# Altium schematic sheet SiLPA_HE_LVDS_IFC.SchDoc: SiLPA HE
size 420 x 297 mm; EDA_Number: ARTIQ; Projet: ARTIQ/SINARA; Author: G.Kasprowicz; CompanyName: WUT ISE; DrawnBy: G.Kasprowicz; Organization: WUT ISE; Address1: PW ISE; Address2: Nowowiejska 15/19 00-665 Warsaw; Address3: gkasprow@gmail.com; DocumentNumber: 7; Revision: 2; SheetNumber: 7; SheetTotal: 7; ModifiedBy: -; CheckedDate: -; Title2: EEM connectors; DivGrp: WUT ISE; Designer: G.Kasprowicz; SPICEModelCache: <root> / <DocumentId>MJNKMGWL</DocumentId> / <CacheFrame Number="0"> / <Model Name="pk14" Kind="CKT"> / <Text>*.INC dhvqfn.s / .SUBCKT pk14 / +    1   2   3   4   5   6   7   8   9  10 / +   11  12  13  14 / +   15  16  17  18  19  20  21  22  23  24 / +   25  26  27  28 / * Pin Resistance / r1 1 1001 9.078E-02 / r2 2 1002 8.829E-02 / r3 3 1003 8.731E-02 / r4 4 1004 8.710E-02 / r5 5 1005 8.731E-02 / r6 6 1006 8.829E-02 / r7 7 1007 9.075E-02 / r8 8 1008 9.072E-02 / r9 9 1009 8.809E-02 / r10 10 1010 8.716E-02 / r11 11 1011 8.706E-02 / r12 12 1012 8.720E-02 / r13 13 1013 8.816E-02 / r14 14 1014 9.068E-02 / * Pin Inductance / l1 1001 15 2.981E-09 / l2 1002 16 2.447E-09 / l3 1003 17 2.304E-09 / l4 1004 18 2.291E-09 / l5 1005 19 2.307E-09 / l6 1006 20 2.449E-09 / l7 1007 21 2.971E-09 / l8 1008 22 2.972E-09 / l9 1009 23 2.425E-09 / l10 1010 24 2.286E-09 / l11 1011 25 2.280E-09 / l12 1012 26 2.286E-09 / l13 1013 27 2.425E-09 / l14 1014 28 2.975E-09 / .ENDS pk14</Text> / </Model> / </CacheFrame> / </root>; ModifiedDate: -; ProjectName: Sensor Box
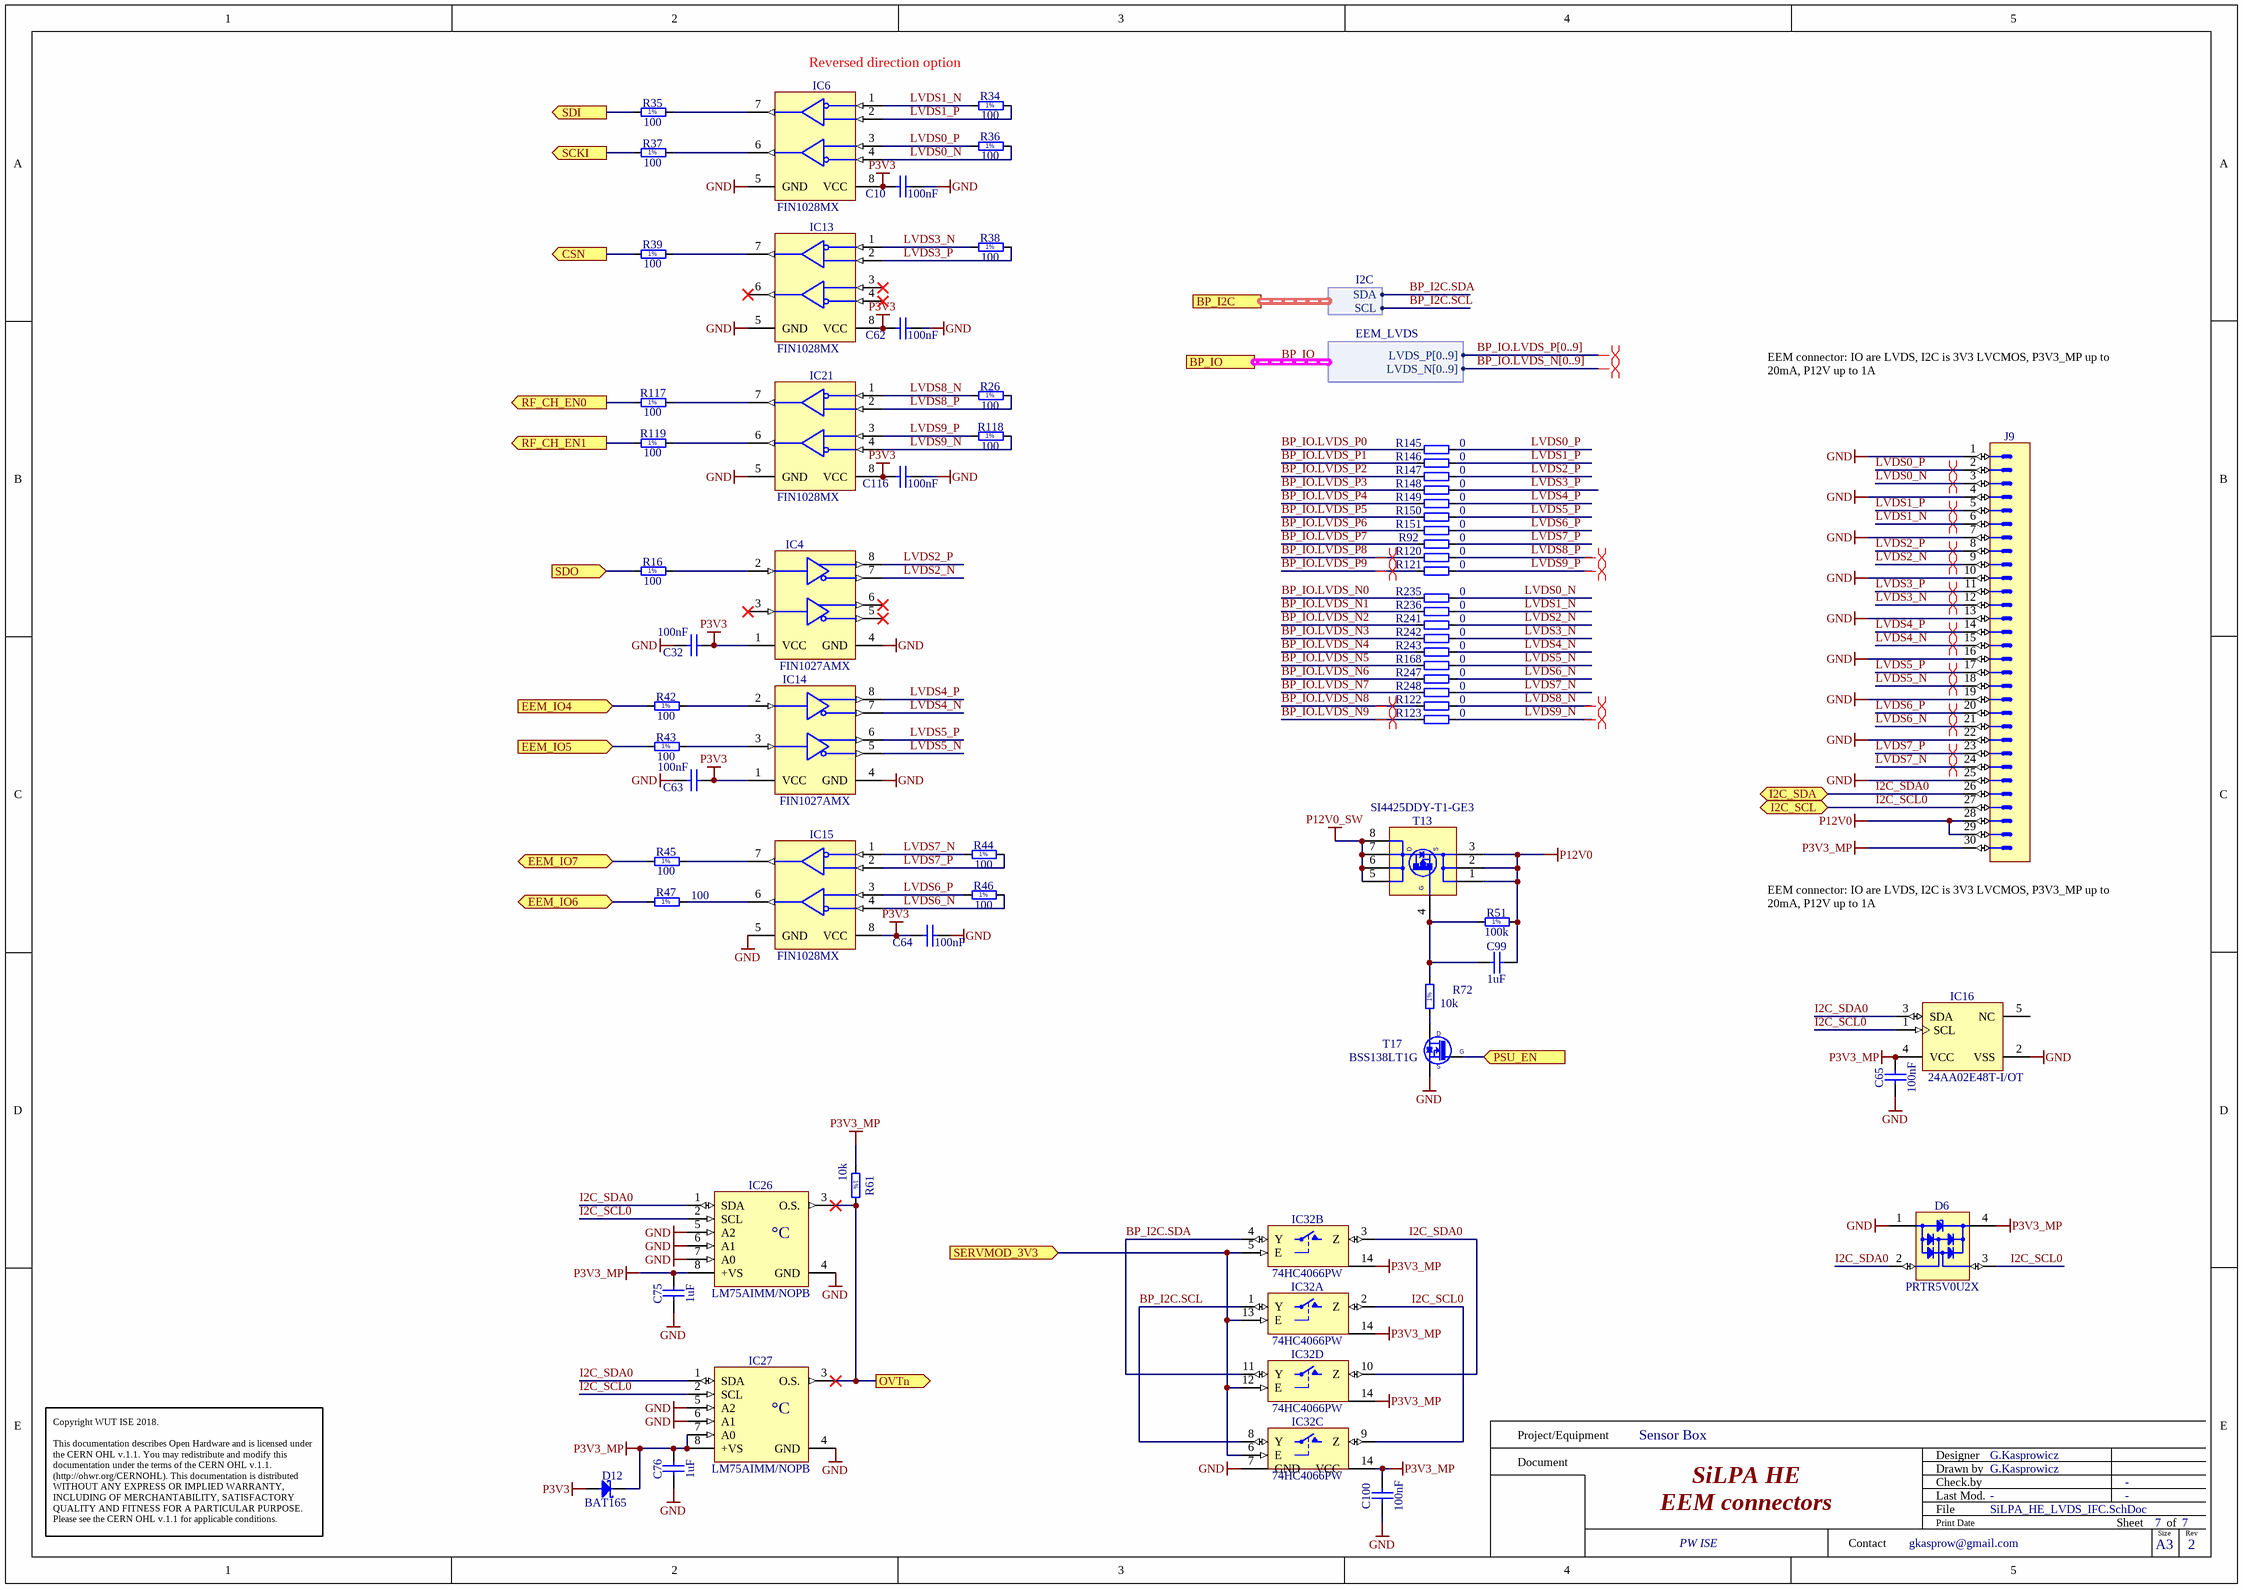
[diagram p0: SiLPA_HE_LVDS_IFC.SchDoc]

## Parts
C10  100nF  [CAPC1005X55N]
C32  100nF  [CAPC1005X55N]
C62  100nF  [CAPC1005X55N]
C63  100nF  [CAPC1005X55N]
C64  100nF  [CAPC1005X55N]
C65  100nF  [CAPC1005X55N]
C75  1uF  [CAPC1005X55N]
C76  1uF  [CAPC1005X55N]
C99  1uF  [CAPC1005X55N]
C100  100nF  [CAPC1005X55N]
C116  100nF  [CAPC1005X55N]
D6  PRTR5V0U2X  [SOT190P230X110-4N]
D12  BAT165  [SOD2512X110N]
IC4  FIN1027AMX  [SOIC127P600X175-8N]
IC6  FIN1028MX  [SOIC127P600X175-8N]
IC13  FIN1028MX  [SOIC127P600X175-8N]
IC14  FIN1027AMX  [SOIC127P600X175-8N]
IC15  FIN1028MX  [SOIC127P600X175-8N]
IC16  24AA02E48T-I/OT  [SOT95P280X145-5N]
IC21  FIN1028MX  [SOIC127P600X175-8N]
IC26  LM75AIMM/NOPB  [SOP65P490X109-8N]
IC27  LM75AIMM/NOPB  [SOP65P490X109-8N]
IC32  74HC4066PW  [SOP65P640X110-14N]  (parts A,B,C,D of 4)
J9  (no value)  [3M_N2530-6002RB]
R16  100  [RESC1005X40N]
R26  100  [RESC1005X40N]
R34  100  [RESC1005X40N]
R35  100  [RESC1005X40N]
R36  100  [RESC1005X40N]
R37  100  [RESC1005X40N]
R38  100  [RESC1005X40N]
R39  100  [RESC1005X40N]
R42  100  [RESC1005X40N]
R43  100  [RESC1005X40N]
R44  100  [RESC1005X40N]
R45  100  [RESC1005X40N]
R46  100  [RESC1005X40N]
R47  100  [RESC1005X40N]
R51  100k  [RESC1608X55N]
R61  10k  [RESC1005X40N]
R72  10k  [RESC1005X40N]
R92  0  [RESC1005X40N]
R117  100  [RESC1005X40N]
R118  100  [RESC1005X40N]
R119  100  [RESC1005X40N]
R120  0  [RESC1005X40N]
R121  0  [RESC1005X40N]
R122  0  [RESC1005X40N]
R123  0  [RESC1005X40N]
R145  0  [RESC1005X40N]
R146  0  [RESC1005X40N]
R147  0  [RESC1005X40N]
R148  0  [RESC1005X40N]
R149  0  [RESC1005X40N]
R150  0  [RESC1005X40N]
R151  0  [RESC1005X40N]
R168  0  [RESC1005X40N]
R235  0  [RESC1005X40N]
R236  0  [RESC1005X40N]
R241  0  [RESC1005X40N]
R242  0  [RESC1005X40N]
R243  0  [RESC1005X40N]
R247  0  [RESC1005X40N]
R248  0  [RESC1005X40N]
T13  SI4425DDY-T1-GE3  [SOIC127P600X175-8N]
T17  BSS138LT1G  [SOT95P240X110-3N]

## Ports
BP_I2C (harness I2C), BP_IO (harness EEM_LVDS), CSN (out), EEM_IO4 (in), EEM_IO5 (in), EEM_IO6 (bidir), EEM_IO7 (bidir), I2C_SCL (bidir), I2C_SDA (bidir), OVTn (out), PSU_EN (in), RF_CH_EN0 (out), RF_CH_EN1 (out), SCKI (out), SDI (out), SDO (in), SERVMOD_3V3 (in)

## Harnesses
EEM_LVDS: LVDS_P[0..9], LVDS_N[0..9]
I2C: SDA, SCL

## Nets
GND: C10.1 C32.1 C62.1 C63.1 C64.1 C65.1 C75.1 C76.1 C100.1 C116.1 D6.1(GND) IC4.4(GND) IC6.5(GND) IC13.5(GND) IC14.4(GND) IC15.5(GND) IC16.2(VSS) IC21.5(GND) IC26.4(GND) IC26.5(A2) IC26.6(A1) IC26.7(A0) IC27.4(GND) IC27.5(A2) IC27.6(A1) IC32.7(GND) J9.1 J9.4 J9.7 J9.10 J9.13 J9.16 J9.19 J9.22 J9.25 T17.2(S)
P3V3: C10.2 C32.2 C62.2 C63.2 C64.2 C116.2 D12.2(A) IC4.1(VCC) IC6.8(VCC) IC13.8(VCC) IC14.1(VCC) IC15.8(VCC) IC21.8(VCC)
P3V3_MP: C65.2 C75.2 C76.2 C100.2 D6.4(VCC) D12.1(C) IC16.4(VCC) IC26.8(+VS) IC27.7(A0) IC27.8(+VS) IC32.14(VCC) J9.30 R61.1
P12V0: C99.2 J9.28 J9.29 R51.2 T13.1(S) T13.2(S) T13.3(S)
P12V0_SW: T13.5(D) T13.6(D) T13.7(D) T13.8(D)
BP_I2C.SCL: IC32.1(Y) IC32.8(Y) ; port BP_I2C.SCL
BP_I2C.SDA: IC32.4(Y) IC32.11(Y) ; port BP_I2C.SDA
BP_IO.LVDS_N0: R235.1
BP_IO.LVDS_N1: R236.1
BP_IO.LVDS_N2: R241.1
BP_IO.LVDS_N3: R242.1
BP_IO.LVDS_N4: R243.1
BP_IO.LVDS_N5: R168.1
BP_IO.LVDS_N6: R247.1
BP_IO.LVDS_N7: R248.1
BP_IO.LVDS_N8: R122.1
BP_IO.LVDS_N9: R123.1
BP_IO.LVDS_P0: R145.1
BP_IO.LVDS_P1: R146.1
BP_IO.LVDS_P2: R147.1
BP_IO.LVDS_P3: R148.1
BP_IO.LVDS_P4: R149.1
BP_IO.LVDS_P5: R150.1
BP_IO.LVDS_P6: R151.1
BP_IO.LVDS_P7: R92.1
BP_IO.LVDS_P8: R120.1
BP_IO.LVDS_P9: R121.1
CSN: R39.1 ; port CSN
EEM_IO4: R42.1 ; port EEM_IO4
EEM_IO5: R43.1 ; port EEM_IO5
EEM_IO6: R47.1 ; port EEM_IO6
EEM_IO7: R45.1 ; port EEM_IO7
I2C_SCL0: D6.3(I/O2) IC16.1(SCL) IC26.2(SCL) IC27.2(SCL) IC32.2(Z) IC32.9(Z) J9.27 ; port I2C_SCL
I2C_SDA0: D6.2(I/O1) IC16.3(SDA) IC26.1(SDA) IC27.1(SDA) IC32.3(Z) IC32.10(Z) J9.26 ; port I2C_SDA
LVDS0_N: IC6.4(RIN2-) J9.3 R36.2 R235.2
LVDS0_P: IC6.3(RIN2+) J9.2 R36.1 R145.2
LVDS1_N: IC6.1(RIN1-) J9.6 R34.1 R236.2
LVDS1_P: IC6.2(RIN1+) J9.5 R34.2 R146.2
LVDS2_N: IC4.7(DOUT-) J9.9 R241.2
LVDS2_P: IC4.8(DOUT+) J9.8 R147.2
LVDS3_N: IC13.1(RIN1-) J9.12 R38.1 R242.2
LVDS3_P: IC13.2(RIN1+) J9.11 R38.2 R148.2
LVDS4_N: IC14.7(DOUT-) J9.15 R243.2
LVDS4_P: IC14.8(DOUT+) J9.14 R149.2
LVDS5_N: IC14.5(DOUT-) J9.18 R168.2
LVDS5_P: IC14.6(DOUT+) J9.17 R150.2
LVDS6_N: IC15.4(RIN2-) J9.21 R46.2 R247.2
LVDS6_P: IC15.3(RIN2+) J9.20 R46.1 R151.2
LVDS7_N: IC15.1(RIN1-) J9.24 R44.1 R248.2
LVDS7_P: IC15.2(RIN1+) J9.23 R44.2 R92.2
LVDS8_N: IC21.1(RIN1-) R26.1 R122.2
LVDS8_P: IC21.2(RIN1+) R26.2 R120.2
LVDS9_N: IC21.4(RIN2-) R118.2 R123.2
LVDS9_P: IC21.3(RIN2+) R118.1 R121.2
OVTn: IC26.3(O.S.) IC27.3(O.S.) R61.2 ; port OVTn
PSU_EN: T17.1(G) ; port PSU_EN
RF_CH_EN0: R117.1 ; port RF_CH_EN0
RF_CH_EN1: R119.1 ; port RF_CH_EN1
SCKI: R37.1 ; port SCKI
SDI: R35.1 ; port SDI
SDO: R16.1 ; port SDO
SERVMOD_3V3: IC32.5(E) IC32.6(E) IC32.12(E) IC32.13(E) ; port SERVMOD_3V3
NetC99_1: C99.1 R51.1 R72.2 T13.4(S)
NetIC4_2: IC4.2(DIN1) R16.2
NetIC6_6: IC6.6(ROUT2) R37.2
NetIC6_7: IC6.7(ROUT1) R35.2
NetIC13_7: IC13.7(ROUT1) R39.2
NetIC14_2: IC14.2(DIN1) R42.2
NetIC14_3: IC14.3(DIN2RIN-) R43.2
NetIC15_6: IC15.6(ROUT2) R47.2
NetIC15_7: IC15.7(ROUT1) R45.2
NetIC21_6: IC21.6(ROUT2) R119.2
NetIC21_7: IC21.7(ROUT1) R117.2
NetR72_1: R72.1 T17.3(D)

Not connected (* = marked no-connect by the designer): IC4 3(DIN2RIN-)* 5(DOUT-)* 6(DOUT+)*; IC13 3(RIN2+)* 4(RIN2-)* 6(ROUT2)*; IC16 5(NC)

## Buses and harness runs
bus BP_IO.LVDS_N[0..9]
bus BP_IO.LVDS_P[0..9]
harness BP_IO = port BP_IO

## Layout directives
differential pair; differential pair class EEM0; net class EEM0: BP_IO.LVDS_N8, BP_IO.LVDS_N9, BP_IO.LVDS_P8, BP_IO.LVDS_P9, LVDS0_N, LVDS0_P, LVDS1_N, LVDS1_P, LVDS2_N, LVDS2_P, LVDS3_N, LVDS3_P, LVDS4_N, LVDS4_P, LVDS5_N, LVDS5_P, LVDS6_N, LVDS6_P, LVDS7_N, LVDS7_P, LVDS8_N, LVDS8_P, LVDS9_N, LVDS9_P
differential pair: (no net found under the mark)

## Notes on the sheet
- Reversed direction option
- (near J9) EEM connector: IO are LVDS, I2C is 3V3 LVCMOS, P3V3_MP up to 20mA, P12V up to 1A
- Project/Equipment
- Document
- Designer
- Drawn by
- Check.by
- Copyright WUT ISE 2018.
  This documentation describes Open Hardware and is licensed under the CERN OHL v.1.1. You may redistribute and modify this documentation under the terms of the CERN OHL v.1.1. (http://ohwr.org/CERNOHL). This documentation is distributed WITHOUT ANY EXPRESS OR IMPLIED WARRANTY, INCLUDING OF MERCHANTABILITY, SATISFACTORY QUALITY AND FITNESS FOR A PARTICULAR PURPOSE. Please see the CERN OHL v.1.1 for applicable conditions.
- Contact
- File
- Last Mod.
- Print Date
- Sheet
- Size
- A3
- of
- Rev
- (in symbol LM75AIMM/NOPB) °C
- (in symbol R0402_10K_1%_0.0625W_100PPM) 1%
- (in symbol R0402_100R_1%_0.0625W_100PPM) 1%
- (in symbol R0603_100K_1%_0.1W_100PPM) 1%
- (in symbol SI4425DDY-T1-GE3) G

## Library data of the parts
C10 C32 C62-C65 C100 C116 = CC0402_100NF_16V_10%_X5R: Non-polarised capacitor; Part Description: SMD Multilayer Chip Ceramic Capacitor; Manufacturer: GENERIC; Manufacturer1 Part Number: GRM155R61C104KA88D; Voltage: 16V; TC: X5R; Tolerance: ±10%; Part Number: CC0402_100NF_16V_10%_X5R; Component Kind: Standard; Component Type: Standard; Pin Count: 2; Value: 100nF; Status: None; Manufacturer Part Number: CC0402_100NF_16V_10%_X5R; Case: 0402; Mounted: Yes; Socket: No; SMD: Yes; Sense: No; Manufacturer1 Example: MURATA; Manufacturer1 ComponentHeight: 0.55mm; HelpURL: \\cern.ch\dfs\Applications\Altium\Datasheets\CC0402_X5R_MURATA_GRM.pdf; Author: CERN DEM JLC; CreateDate: 10.12.2013; LatestRevisionDate: 10.12.2013
C75 C76 C99 = CC0402_1UF_16V_10%_X5R: Non-polarised capacitor; Part Description: SMD Multilayer Chip Ceramic Capacitor; Manufacturer: GENERIC; Manufacturer1 Part Number: C1005X5R1C105KT; Voltage: 16V; TC: X5R; Tolerance: ±10%; Part Number: CC0402_1UF_16V_10%_X5R; Component Kind: Standard; Component Type: Standard; Pin Count: 2; Value: 1uF; Status: Preferred; Manufacturer Part Number: CC0402_1UF_16V_10%_X5R; Case: 0402; Mounted: Yes; Socket: No; SMD: Yes; Sense: No; Manufacturer1 Example: TDK; Manufacturer1 ComponentHeight: 0.55mm; HelpURL: \\cern.ch\dfs\Applications\Altium\Datasheets\CC0402_X5R_TDK_C.pdf; Author: CERN DEM JLC
  C75 C76: CreateDate: 25.10.2012; LatestRevisionDate: 25.10.2012
  C99: CreateDate: 2012-10-25; LatestRevisionDate: 2012-10-25
D6 = PRTR5V0U2X: Ultra Low Capacitance Double Rail-to-Rail ESD Protection Diode; Part Description: Ultra Low Capacitance (1pF) Double Rail-to-Rail ESD Protection Diode (8kV); Manufacturer: NXP SEMICONDUCTORS; Voltage: 5.5V; PressFit: No; Bonding: No; Part Number: PRTR5V0U2X; Component Kind: Standard; Component Type: Standard; Device: PRTR5V0U2X; PackageDescription: SOT143B, SOT, 1.90mm Pitch; 4 Pin, 1.30mm W X 2.90mm L X 1.10mm H body, IPC Medium Density; Manufacturer Part Number: PRTR5V0U2X; Pin Count: 4; Case: SOT143B; Mounted: Yes; Socket: No; SMD: Yes; Sense: No; ComponentHeight: 1.1mm; HelpURL: \\cern.ch\dfs\Applications\Altium\Datasheets\PRTR5V0U2X.pdf; Author: CERN DEM JLC; CreateDate: 22.03.2011; LatestRevisionDate: 22.03.2011
D12 = BAT165: Schottky Diode; Part Description: Medium Power AF Schottky Diode; Manufacturer: INFINEON; Voltage: 40V; Power: 750mA; PressFit: No; Bonding: No; Part Number: BAT165; Component Kind: Standard; Component Type: Standard; Device: BAT165; PackageDescription: Small Outline Diode Flat Lead (SOD-323), 1.70mm W X 1.25mm L X 1.10mm H body,  IPC Medium Density; Manufacturer Part Number: BAT165; Pin Count: 2; Case: SOD323; Mounted: Yes; Socket: No; SMD: Yes; Sense: No; ComponentHeight: 1.1mm; HelpURL: \\cern.ch\dfs\Applications\Altium\Datasheets\BAT165.pdf; Author: CERN DEM JLC; CreateDate: 12.11.2014; LatestRevisionDate: 12.11.2014
IC4 IC14 = IFC_FIN1027A: 3.3V LVDS, 2-Bit, High-Speed, Differential Driver; Manufacturer: ON Semiconductor; PressFit: No; Bonding: No; Part Number: FIN1027AMX; Component Kind: Standard; Component Type: Standard; Device: FIN1027AMX; PackageDescription: SOIC 8, Pitch 1.27mm - Body 4x5mm, IPC Medium Density; Part Description: 3.3V LVDS, 2-Bit, High-Speed, Differential Driver; Manufacturer Part Number: FIN1027AMX; Pin Count: 8; Case: SOIC8; Mounted: Yes; Socket: No; SMD: Yes; Sense: No; ComponentHeight: 0.8mm; Author: GK; HelpURL: \\cern.ch\dfs\Applications\Altium\Datasheets\FIN1101K8X.pdf; CreateDate: 08/11/2016; LatestRevisionDate: 08/11/2016
IC6 IC13 IC15 IC21 = IFC_FIN1028: 3.3V LVDS 2-Bit High-Speed Differential Reciever; Manufacturer: ON Semiconductor; PressFit: No; Bonding: No; Part Number: FIN1028MX; Component Kind: Standard; Component Type: Standard; Device: FIN1028MX; PackageDescription: SOIC 8, Pitch 1.27mm - Body 4x5mm, IPC Medium Density; Part Description: 3.3V LVDS 2-Bit High-Speed Differential Reciever; Manufacturer Part Number: FIN1028MX; Pin Count: 8; Case: SOIC8; Mounted: Yes; Socket: No; SMD: Yes; Sense: No; ComponentHeight: 0.8mm; Author: GK; HelpURL: \\cern.ch\dfs\Applications\Altium\Datasheets\FIN1101K8X.pdf; CreateDate: 08/11/2016; LatestRevisionDate: 08/11/2016
IC16 = 24AA02E48T-I/OT: 1.7V-5.5V, 2K I2C Serial EEPROM With EUI-48 Node Identity; Manufacturer: MICROCHIP TECHNOLOGY; PressFit: No; Bonding: No; Part Number: 24AA02E48T-I/OT; Component Kind: Standard; Component Type: Standard; Device: 24AA02E48T-I/OT; PackageDescription: SOT, 0.95mm pitch; 5 pin, 1.60mm W X 2.90mm L X 1.45mm H body, IPC Medium Density; Part Description: 1.7V-5.5V, 2K I2C Serial EEPROM With EUI-48 Node Identity; Manufacturer Part Number: 24AA02E48T-I/OT; Pin Count: 5; Case: SOT23-5; Mounted: Yes; Socket: No; SMD: Yes; Sense: No; ComponentHeight: 1.45mm; HelpURL: \\cern.ch\dfs\Applications\Altium\Datasheets\24AA02E48T-I-OT.pdf; Author: CERN DEM MR; CreateDate: 31.03.2016; LatestRevisionDate: 31.03.2016
IC26 IC27 = LM75AIMM/NOPB: Digital Temperature Sensor and Thermal Watchdog with Two-Wire Interface; Part Description: -25° to +100°C ±2°C Digital Temperature Sensor and Thermal Watchdog with Two-Wire Interface; Manufacturer: TEXAS INSTRUMENTS; PressFit: No; Bonding: No; Part Number: LM75AIMM/NOPB; Component Kind: Standard; Component Type: Standard; Device: LM75AIMM/NOPB; PackageDescription: SOP, 0.65mm pitch; 8 pin,3.00mm W X 3.00mm L X 1.09mm H bodyI, PC Medium Density; Manufacturer Part Number: LM75AIMM/NOPB; Pin Count: 8; Case: SSOP8; Mounted: Yes; Socket: No; SMD: Yes; Sense: No; ComponentHeight: 1.09mm; HelpURL: \\cern.ch\dfs\Applications\Altium\Datasheets\LM75AIMM-NOPB.pdf; Author: CERN DEM JLC; CreateDate: 15.10.2012; LatestRevisionDate: 15.10.2012
IC32 = 74HC4066PW: Part Description: Quad Single-Pole Single-Throw Analog Switch; Manufacturer: NXP SEMICONDUCTORS; PressFit: No; Bonding: No; Table: Standard Logic; Part Number: 74HC4066PW; Component Kind: Standard; Component Type: Standard; Device: 74HC4066PW; PackageDescription: SOP, 14-Leads, Body 4.4x5mm (max), Pitch 0.65mm, IPC Medium Density; Manufacturer Part Number: 74HC4066PW; Pin Count: 14; Case: TSSOP14; Mounted: Yes; Socket: No; SMD: Yes; ComponentHeight: 1.1mm; Author: CERN DEM JLC; HelpURL: \\cern.ch\dfs\Applications\Altium\Datasheets\74HC4066PW.pdf; CreateDate: 2014-11-19; LatestRevisionDate: 2014-11-19
J9 = 3M_N2530-6002RB: Connector 30 Male; Part Description: 30 Contacts - Straight .100'' x .100'' Low Profile Four-Wall Header, 2500 Series; Manufacturer: 3M; PressFit: No; Part Number: 3M_N2530-6002RB; Component Kind: Standard; Component Type: Standard; Pin Count: 30; Family: Header 30; Mounted: Yes; Socket: No; SMD: No; Sense: No; Status: None; Manufacturer Part Number: N2530-6002RB; ComponentHeight: 10.03mm; HelpURL: \\cern.ch\dfs\Applications\Altium\Datasheets\3M_N2530-6002RB.pdf; Author: CERN DEM JLC; CreateDate: 11.02.2009; LatestRevisionDate: 11.08.2009
R16 R26 R34-R39 R42-R47 R117-R119 = R0402_100R_1%_0.0625W_100PPM: Resistor - 1%; Part Description: General Purpose Thick Film Chip Resistor; Manufacturer: GENERIC; Manufacturer1 Part Number: 232270671001L; TC: ±100ppm/°C; PressFit: No; Part Number: R0402_100R_1%_0.0625W_100PPM; Component Kind: Standard; Component Type: Standard; Pin Count: 2; Value: 100; Status: Not Recommended; Power: 0.0625W; Tolerance: ±1%; Manufacturer Part Number: R0402_100R_1%_0.0625W_100PPM; Case: 0402; Mounted: Yes; Sense: No; Socket: No; SMD: Yes; Manufacturer1 Example: YAGEO PHYCOMP; Manufacturer1 ComponentHeight: 0.4mm; HelpURL: \\cern.ch\dfs\Applications\Altium\Datasheets\R0402_Phycomp_RC0402.pdf; Author: CERN DEM JLC; CreateDate: 03.12.2007; LatestRevisionDate: 17.10.2012
R51 = R0603_100K_1%_0.1W_100PPM: Resistor - 1%; Part Description: General Purpose Thick Film Chip Resistor; Manufacturer: GENERIC; Manufacturer1 Part Number: NRC06F1003TRF; Power: 0.1W; TC: ±100ppm/°C; Part Number: R0603_100K_1%_0.1W_100PPM; Component Kind: Standard; Component Type: Standard; Pin Count: 2; Value: 100k; Status: Preferred; Tolerance: ±1%; Manufacturer Part Number: R0603_100K_1%_0.1W_100PPM; Case: 0603; Mounted: Yes; Sense: No; Socket: No; SMD: Yes; Manufacturer1 Example: NIC COMPONENT; Manufacturer1 ComponentHeight: 0.55mm; HelpURL: \\cern.ch\dfs\Applications\Altium\Datasheets\R0603_NIC_NRC.pdf; Author: CERN DEM JLC; CreateDate: 2007-12-03; LatestRevisionDate: 2008-03-13
R61 = R0402_10K_1%_0.0625W_100PPM: Resistor - 1%; Part Description: General Purpose Thick Film Chip Resistor; Manufacturer: GENERIC; Manufacturer1 Part Number: 232270671003L; TC: ±100ppm/°C; Table: Resistors SMD; Part Number: R0402_10K_1%_0.0625W_100PPM; Component Kind: Standard; Component Type: Standard; Pin Count: 2; Value: 10k; Status: Not recommended; Power: 0.0625W; Tolerance: ±1%; Manufacturer Part Number: R0402_10K_1%_0.0625W_100PPM; Case: 0402; Mounted: Yes; Socket: No; SMD: Yes; Manufacturer1 Example: YAGEO PHYCOMP; Manufacturer1 ComponentHeight: 0.4mm; HelpURL: \\cern.ch\dfs\Applications\Altium\Datasheets\R0402_Phycomp_RC0402.pdf; Author: CERN DEM JLC; CreateDate: 2007-12-03; LatestRevisionDate: 2012-10-17
R72 = R0402_10K_1%_0.0625W_100PPM: Resistor - 1%; Part Description: General Purpose Thick Film Chip Resistor; Manufacturer: GENERIC; Manufacturer1 Part Number: 232270671003L; TC: ±100ppm/°C; Part Number: R0402_10K_1%_0.0625W_100PPM; Component Kind: Standard; Component Type: Standard; Pin Count: 2; Value: 10k; Status: Not recommended; Power: 0.0625W; Tolerance: ±1%; Manufacturer Part Number: R0402_10K_1%_0.0625W_100PPM; Case: 0402; Mounted: Yes; Sense: No; Socket: No; SMD: Yes; Manufacturer1 Example: YAGEO PHYCOMP; Manufacturer1 ComponentHeight: 0.4mm; HelpURL: \\cern.ch\dfs\Applications\Altium\Datasheets\R0402_Phycomp_RC0402.pdf; Author: CERN DEM JLC; CreateDate: 2007-12-03; LatestRevisionDate: 2012-10-17
R92 R120-R123 R145-R151 R168 R235 R236 R241-R243 R247 R248 = R0402_0R_JUMPER: Resistor; Part Description: 1A (0.05R Max DC Resistance) Zero Ohm Jumper; Manufacturer: GENERIC; Manufacturer1 Part Number: 232270591001L; PressFit: No; Part Number: R0402_0R_JUMPER; Component Kind: Standard; Component Type: Standard; Pin Count: 2; Value: 0; Status: Not Recommended; Manufacturer Part Number: R0402_0R_JUMPER; Case: 0402; Mounted: Yes; Sense: No; Socket: No; SMD: Yes; Manufacturer1 Example: YAGEO PHYCOMP; Manufacturer1 ComponentHeight: 0.4mm; HelpURL: \\cern.ch\dfs\Applications\Altium\Datasheets\R0402_Phycomp_RC0402.pdf; Author: CERN DEM JLC; CreateDate: 03.12.2007; LatestRevisionDate: 17.10.2012
T13 = SI4425DDY-T1-GE3: -30V -19.7A P-Channel MOSFET; Manufacturer: VISHAY SILICONIX; PressFit: No; Bonding: No; Part Number: SI4425DDY-T1-GE3; Component Kind: Standard; Component Type: Standard; Device: SI4425DDY-T1-GE3; PackageDescription: SOIC 8, Pitch 1.27mm - Body 4x5mm, IPC Medium Density; Part Description: -30V -19.7A P-Channel MOSFET; Manufacturer Part Number: SI4425DDY-T1-GE3; Pin Count: 8; Case: SOIC8; Mounted: Yes; Socket: No; SMD: Yes; Sense: No; ComponentHeight: 1.75mm; HelpURL: \\cern.ch\dfs\Applications\Altium\Datasheets\SI4425DDY-T1-GE3.pdf; Author: CERN DEM MR; CreateDate: 05/10/2016; LatestRevisionDate: 05/10/2016
T17 = BSS138LT1G: N-CHANNEL MOSFET WITH DIODE; Part Description: 50V 200mA N-Channel Enhancement Mode Field-Effect Transistor; Manufacturer: ON SEMICONDUCTOR; PressFit: No; Bonding: No; Part Number: BSS138LT1G; Component Kind: Standard; Component Type: Standard; Device: BSS138LT1G; PackageDescription: SOT23 3-Leads, Pitch 0.95mm - Body 1.4x3mm, IPC Medium Density; Manufacturer Part Number: BSS138LT1G; Pin Count: 3; Case: SOT23-3; Mounted: Yes; Socket: No; SMD: Yes; Sense: No; ComponentHeight: 1.11mm; HelpURL: \\cern.ch\dfs\Applications\Altium\Datasheets\BSS138LT1G.pdf; Author: CERN DEM JLC; CreateDate: 23.03.2009; LatestRevisionDate: 23.03.2009